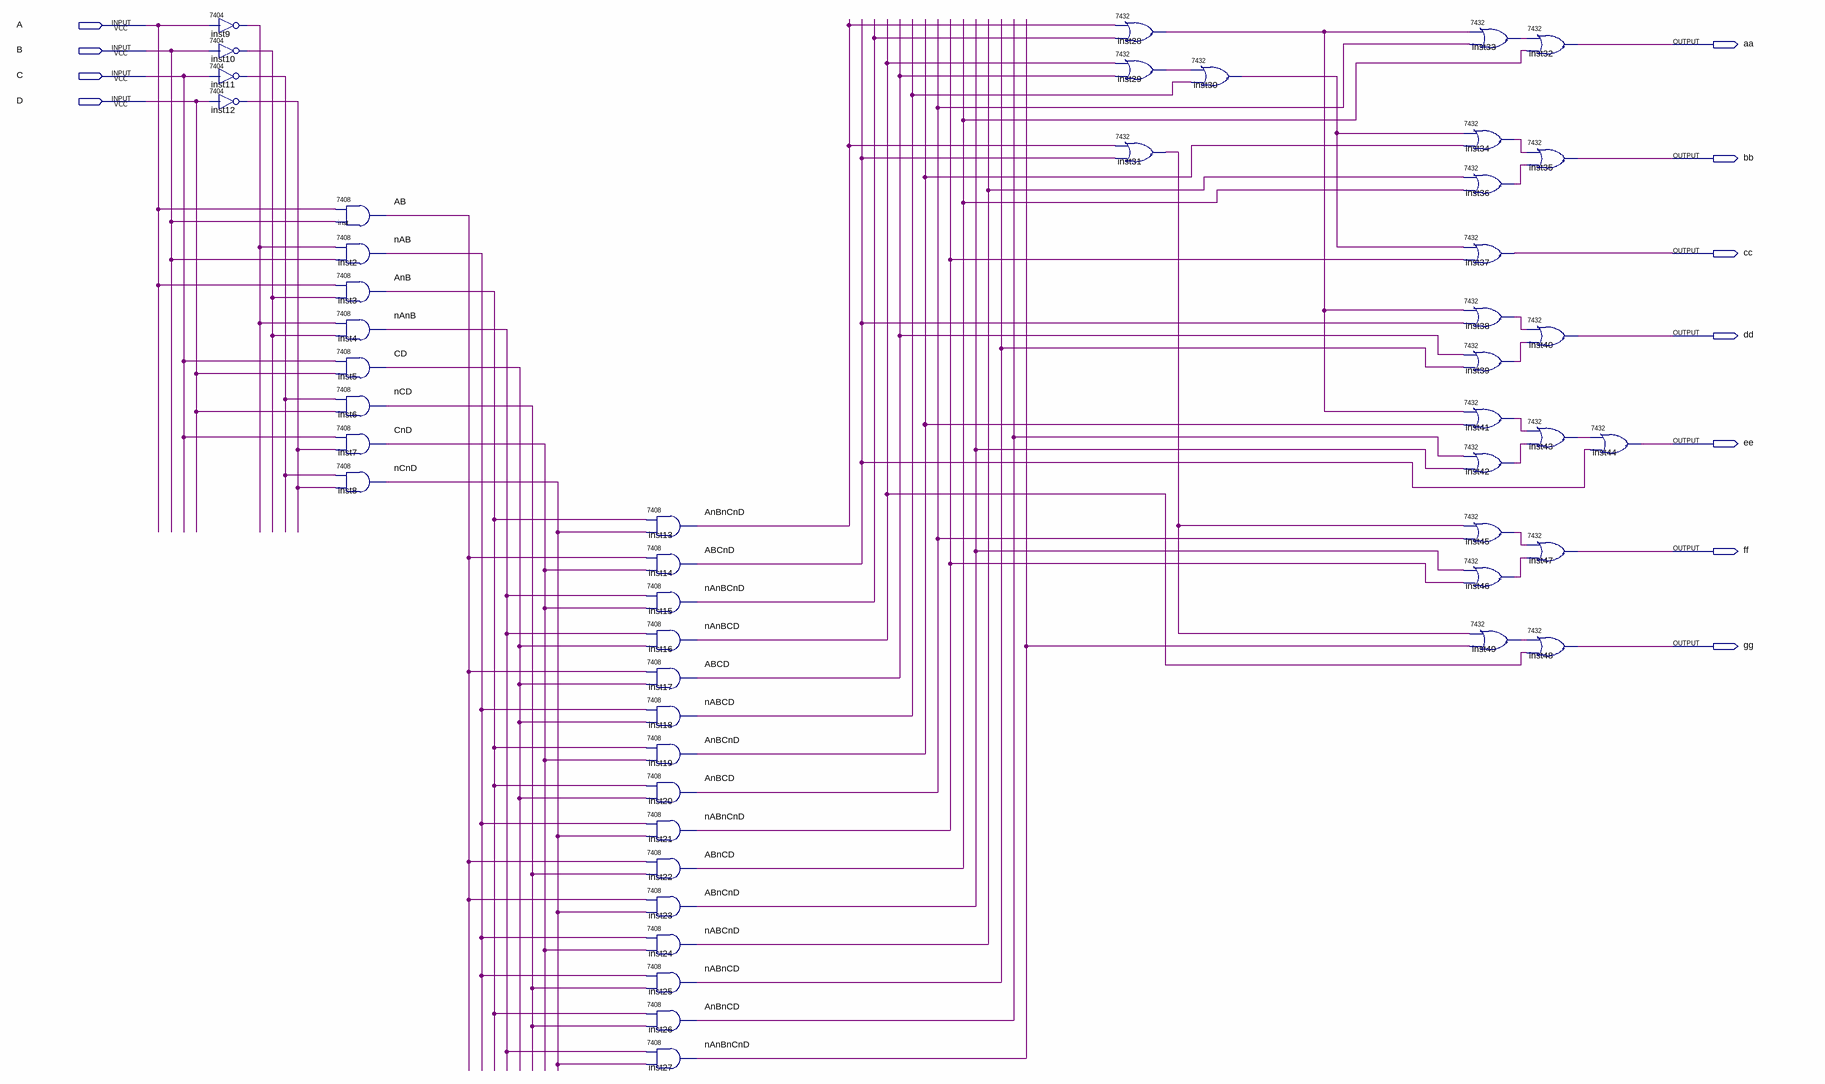
[diagram p0: schematic sheet]
// Quartus schematic decoder_7seg.bdf as structural Verilog: 49 symbols, 11 pins
module decoder_7seg (
  input  A,
  input  B,
  input  C,
  input  D,
  output aa,
  output bb,
  output cc,
  output dd,
  output ee,
  output ff,
  output gg
);

  wire AB, ABCD, ABCnD, ABnCD, ABnCnD, AnB, AnBCD, AnBCnD, AnBnCD, AnBnCnD, CD, CnD, inst9_1, inst10_1,
       inst11_1, inst12_1, inst28_1, inst29_1, inst30_1, inst31_1, inst33_1, inst34_1, inst36_1, inst38_1,
       inst39_1, inst41_1, inst42_1, inst43_1, inst45_1, inst46_1, inst49_1, nAB, nABCD, nABCnD, nABnCD,
       nABnCnD, nAnB, nAnBCD, nAnBCnD, nAnBnCnD, nCD, nCnD;

  \7404  inst9 (.\2 (A), .\1 (inst9_1));
  \7404  inst10 (.\2 (B), .\1 (inst10_1));
  \7404  inst11 (.\2 (C), .\1 (inst11_1));
  \7404  inst12 (.\2 (D), .\1 (inst12_1));
  \7408  inst (.\3 (B), .\2 (A), .\1 (AB));
  \7408  inst2 (.\3 (B), .\2 (inst9_1), .\1 (nAB));
  \7408  inst3 (.\3 (inst10_1), .\2 (A), .\1 (AnB));
  \7408  inst4 (.\3 (inst10_1), .\2 (inst9_1), .\1 (nAnB));
  \7408  inst5 (.\3 (D), .\2 (C), .\1 (CD));
  \7408  inst6 (.\3 (D), .\2 (inst11_1), .\1 (nCD));
  \7408  inst7 (.\3 (inst12_1), .\2 (C), .\1 (CnD));
  \7408  inst8 (.\3 (inst12_1), .\2 (inst11_1), .\1 (nCnD));
  \7408  inst13 (.\3 (nCnD), .\2 (AnB), .\1 (AnBnCnD));
  \7408  inst14 (.\3 (CnD), .\2 (AB), .\1 (ABCnD));
  \7408  inst15 (.\3 (CnD), .\2 (nAnB), .\1 (nAnBCnD));
  \7408  inst16 (.\3 (CD), .\2 (nAnB), .\1 (nAnBCD));
  \7408  inst17 (.\3 (CD), .\2 (AB), .\1 (ABCD));
  \7408  inst18 (.\3 (CD), .\2 (nAB), .\1 (nABCD));
  \7408  inst19 (.\3 (CnD), .\2 (AnB), .\1 (AnBCnD));
  \7408  inst20 (.\3 (CD), .\2 (AnB), .\1 (AnBCD));
  \7408  inst21 (.\3 (nCnD), .\2 (nAB), .\1 (nABnCnD));
  \7408  inst22 (.\3 (nCD), .\2 (AB), .\1 (ABnCD));
  \7408  inst23 (.\3 (nCnD), .\2 (AB), .\1 (ABnCnD));
  \7408  inst24 (.\3 (CnD), .\2 (nAB), .\1 (nABCnD));
  \7408  inst25 (.\3 (nCD), .\2 (nAB), .\1 (nABnCD));
  \7408  inst26 (.\3 (nCD), .\2 (AnB), .\1 (AnBnCD));
  \7408  inst27 (.\3 (nCnD), .\2 (nAnB), .\1 (nAnBnCnD));
  \7432  inst28 (.\2 (AnBnCnD), .\3 (nAnBCnD), .\1 (inst28_1));
  \7432  inst29 (.\2 (nAnBCD), .\3 (ABCD), .\1 (inst29_1));
  \7432  inst31 (.\2 (AnBnCnD), .\3 (ABCnD), .\1 (inst31_1));
  \7432  inst30 (.\2 (inst29_1), .\3 (nABCD), .\1 (inst30_1));
  \7432  inst33 (.\2 (inst28_1), .\3 (AnBCD), .\1 (inst33_1));
  \7432  inst34 (.\2 (inst30_1), .\3 (AnBCnD), .\1 (inst34_1));
  \7432  inst36 (.\2 (nABCnD), .\3 (ABnCD), .\1 (inst36_1));
  \7432  inst37 (.\2 (inst30_1), .\3 (nABnCnD), .\1 (cc));
  \7432  inst38 (.\2 (inst28_1), .\3 (ABCnD), .\1 (inst38_1));
  \7432  inst39 (.\2 (ABCD), .\3 (nABnCD), .\1 (inst39_1));
  \7432  inst41 (.\2 (inst28_1), .\3 (AnBCnD), .\1 (inst41_1));
  \7432  inst42 (.\2 (AnBnCD), .\3 (ABnCnD), .\1 (inst42_1));
  \7432  inst45 (.\2 (inst31_1), .\3 (AnBCD), .\1 (inst45_1));
  \7432  inst46 (.\2 (ABnCnD), .\3 (nABnCnD), .\1 (inst46_1));
  \7432  inst49 (.\2 (inst31_1), .\3 (nAnBnCnD), .\1 (inst49_1));
  \7432  inst32 (.\2 (inst33_1), .\3 (ABnCD), .\1 (aa));
  \7432  inst35 (.\2 (inst34_1), .\3 (inst36_1), .\1 (bb));
  \7432  inst40 (.\2 (inst38_1), .\3 (inst39_1), .\1 (dd));
  \7432  inst43 (.\2 (inst41_1), .\3 (inst42_1), .\1 (inst43_1));
  \7432  inst47 (.\2 (inst45_1), .\3 (inst46_1), .\1 (ff));
  \7432  inst48 (.\2 (inst49_1), .\3 (nAnBCD), .\1 (gg));
  \7432  inst44 (.\2 (inst43_1), .\3 (ABCnD), .\1 (ee));
endmodule
